# Altium project 243-TGE-Template.PrjPcb
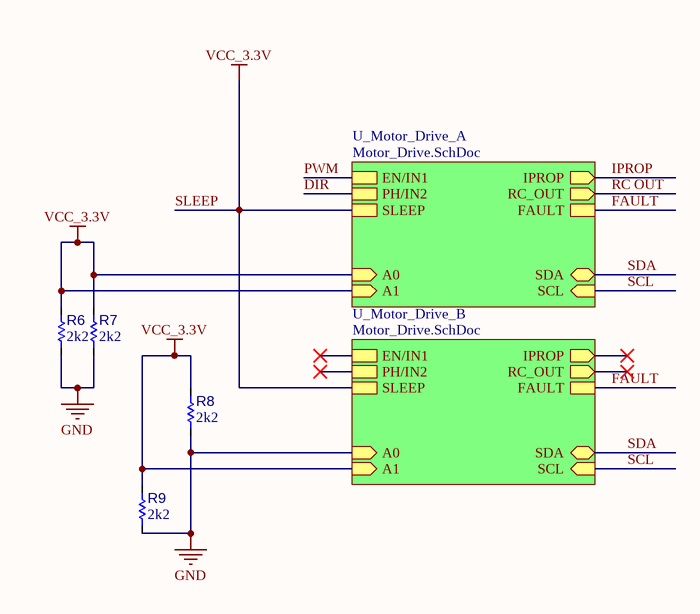
[diagram p0: Page_Tete.SchDoc]
NomDeLetudiant: Le nom de l'étudiant; NomDeProjet: Le nom de mon Projet; Revision: La Revision
4 sheets, 31 parts. Net scope: hierarchical (ports join the sheet entries above them; power ports are global).
Board file: Pcb1.PcbDoc
Sheets:
  Page_Tete.SchDoc
    U_Motor_Drive_A = Motor_Drive.SchDoc
    U_Motor_Drive_B = Motor_Drive.SchDoc
  Connecteur.SchDoc
  Interface_Mikrobus.SchDoc

## Sheet Page_Tete.SchDoc
size A4; SheetNumber: 1; SheetTotal: 4

### Parts
R6  value 2k2  [R_1005[0402]]  (hidden comment: Res 2k2 1% 0402)
R7  value 2k2  [R_1005[0402]]  (hidden comment: Res 2k2 1% 0402)
R8  value 2k2  [R_1005[0402]]  (hidden comment: Res 2k2 1% 0402)
R9  value 2k2  [R_1005[0402]]  (hidden comment: Res 2k2 1% 0402)

### Sub-sheets
U_Motor_Drive_A = Motor_Drive.SchDoc: EN/IN1, PH/IN2, SLEEP, IPROP (out), FAULT, SCL (in), SDA (bidir), A0 (in), A1 (in), RC_OUT (out)
U_Motor_Drive_B = Motor_Drive.SchDoc: EN/IN1, PH/IN2, SLEEP, IPROP (out), FAULT, SCL (in), SDA (bidir), A0 (in), A1 (in), RC_OUT (out)

### Nets
GND: R6.1 R7.1 R8.1 R9.1 ; sheet U_Motor_Drive_B/A0
SLEEP: R6.2 R7.2 R8.2 R9.2 ; sheet U_Motor_Drive_A/SLEEP, sheet U_Motor_Drive_A/A0, sheet U_Motor_Drive_A/A1, sheet U_Motor_Drive_B/SLEEP, sheet U_Motor_Drive_B/A1  [also labelled VCC_3.3V]
FAULT: sheet U_Motor_Drive_A/FAULT, sheet U_Motor_Drive_B/FAULT
SCL: sheet U_Motor_Drive_A/SCL, sheet U_Motor_Drive_B/SCL
SDA: sheet U_Motor_Drive_A/SDA, sheet U_Motor_Drive_B/SDA

### Library data of the parts
R6-R9 = RES008: Resistor type 1; Manufacturer 1: Yageo; Manufacturer Part Number 1: RC0402FR-072K2L; LibRef: RES008; Code CEGEP: RES2.2KSM; Puissance: 1/16W; Max Working Voltage: 50V; Tolerance: 1%; Mounting Technology: SMT; Supplier 1: LCSC; Supplier Part Number 1: C114762; Supplier 2: Digi-Key; Supplier Part Number 2: 311-2.20KLRCT-ND

## Sheet Motor_Drive.SchDoc: TITRE
size Letter; ApprovedBy: APPROUVÉ PAR; Author: Le nom de l'étudiant; Organization: Cegep Limoilou; Address1: 1300, 8e Avenue; Address2: Québec, QC; Address3: Canada; Address4: G1J 5L5; SheetNumber: 3; SheetTotal: 3
Used 2 times, as channels U_Motor_Drive_A, U_Motor_Drive_B. Parts and nets are listed once, with the designators drawn on the sheet.
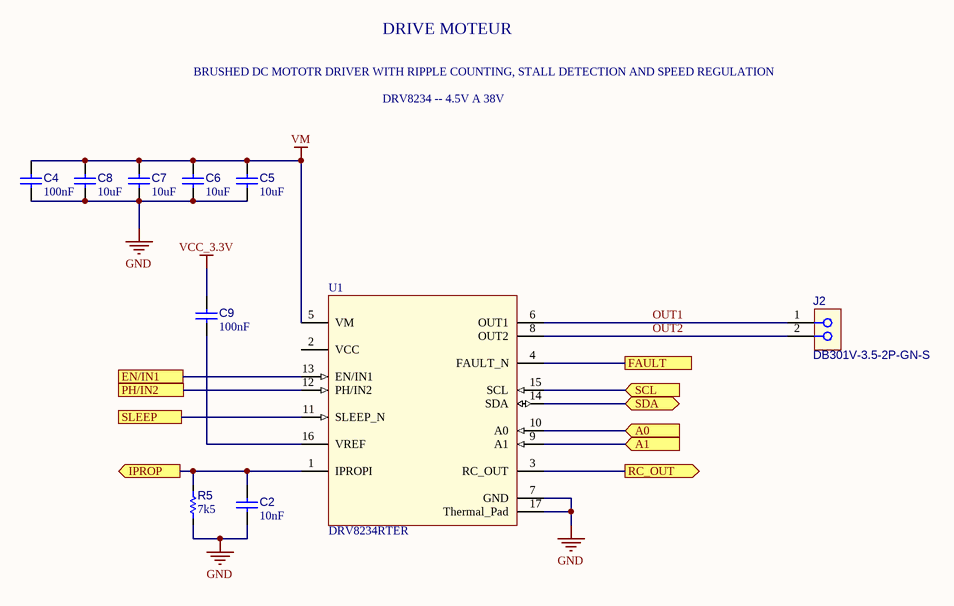
[diagram p1: Motor_Drive.SchDoc]

### Parts
C2  value 10nF  [C_1608[0603]]  (hidden comment: CAP CER 10nF 50V 0603)
C4  value 100nF  [C_2012[0805]]  (hidden comment: CAP CER 100nF 50V 0805)
C5  value 10uF  [C_2012[0805]]  (hidden comment: CAP CER 10uF 10V X7R 0805)
C6  value 10uF  [C_2012[0805]]  (hidden comment: CAP CER 10uF 10V X7R 0805)
C7  value 10uF  [C_2012[0805]]  (hidden comment: CAP CER 10uF 10V X7R 0805)
C8  value 10uF  [C_2012[0805]]  (hidden comment: CAP CER 10uF 10V X7R 0805)
C9  value 100nF  [C_2012[0805]]  (hidden comment: CAP CER 100nF 50V 0805)
J2  DB301V-3.5-2P-GN-S  [CONN_TERM_BLOCK_2POS_3mm5]
R5  value 7k5  [R_1005[0402]]  (hidden comment: Res 7k5 1% 0402)
U1  DRV8234RTER  [U_WQFN50P300X300-16]

### Ports
A0 (in), A1 (in), EN/IN1, FAULT, IPROP (out), PH/IN2, RC_OUT (out), SCL (in), SDA (bidir), SLEEP

### Nets
GND: C2.1 C4.1 C5.2 C6.1 C7.2 C8.1 R5.1 U1.7(GND) U1.17(Thermal_Pad)
VCC_3.3V: C9.2
VM: C4.2 C5.1 C6.2 C7.1 C8.2 U1.5(VM)
A0: U1.10(A0) ; port A0
A1: U1.9(A1) ; port A1
EN/IN1: U1.13(EN/IN1) ; port EN/IN1
FAULT: U1.4(FAULT_N) ; port FAULT
IPROP: C2.2 R5.2 U1.1(IPROPI) ; port IPROP
OUT1: J2.1 U1.6(OUT1)
OUT2: J2.2 U1.8(OUT2)
PH/IN2: U1.12(PH/IN2) ; port PH/IN2
RC_OUT: U1.3(RC_OUT) ; port RC_OUT
SCL: U1.15(SCL) ; port SCL
SDA: U1.14(SDA) ; port SDA
SLEEP: U1.11(SLEEP_N) ; port SLEEP
NetC9_1: C9.1 U1.16(VREF)

Not connected (* = marked no-connect by the designer): U1 2(VCC)

### Channels
U_Motor_Drive_A: designators end in _U_Motor_Drive_A; ports A0=SLEEP A1=SLEEP EN/IN1=PWM FAULT=FAULT IPROP=IPROP PH/IN2=DIR RC_OUT=RC OUT SCL=SCL SDA=SDA SLEEP=SLEEP
U_Motor_Drive_B: designators end in _U_Motor_Drive_B; ports A0=GND A1=SLEEP EN/IN1=NetU1_U_Motor_Drive_B_13 FAULT=FAULT IPROP=NetC2_U_Motor_Drive_B_2 PH/IN2=NetU1_U_Motor_Drive_B_12 RC_OUT=NetU1_U_Motor_Drive_B_3 SCL=SCL SDA=SDA SLEEP=SLEEP

### Notes on the sheet
- BRUSHED DC MOTOTR DRIVER WITH RIPPLE COUNTING, STALL DETECTION AND SPEED REGULATION
- DRIVE MOTEUR
- DRV8234 -- 4.5V A 38V
- Titre :
- Conception :
- Date :
- Approbation :
- Heure :
- Révision :
- Feuille
- de
- Fichier :

### Library data of the parts
C2 = CAP007: Capacitor type 1; Manufacturer 1: Yageo; Manufacturer Part Number 1: CC0603KRX7R9BB103; LibRef: CAP007; Tolerance: 10%; Dielectric: X7R; Rated Voltage: 50V; Mounting Technology: SMT; Supplier 1: LCSC; Supplier Part Number 1: C100042
C4 C9 = CAP008: Capacitor type 1; Manufacturer 1: Yageo; Manufacturer Part Number 1: CC0805KRX7R9BB104; LibRef: CAP008; Code CEGEP: KCOND0142SM; Tolerance: 10%; Dielectric: X7R; Rated Voltage: 50V; Mounting Technology: SMT; Supplier 1: LCSC; Supplier Part Number 1: C49678
C5-C8 = CAP004: Capacitor type 1; Manufacturer 1: muRata; Manufacturer Part Number 1: GRM21BR71A106KE51L; LibRef: CAP004; Code CEGEP: KCOND03SM; Tolerance: 10%; Rated Voltage: 10V; Dielectric: X7R; Mounting Technology: SMT; Supplier 1: LCSC; Supplier Part Number 1: C86038
J2 = CONN-3MM5-2POS-TERM-BLOCK: CONN TERM BLOCK 2POS 3.5mm pitch; Manufacturer 1: Dorabo; Supplier 1: LCSC; Supplier Part Number 1: C695629; Manufacturer Part Number 1: DB301V-3.5-2P-GN-S; Mounting Technology: TH
R5 = RES027: Resistor type 1; Manufacturer 1: Yageo; Manufacturer Part Number 1: RC0402FR-077k5L; LibRef: RES027; Puissance: 1/16W; Max Working Voltage: 50V; Tolerance: 1%; Mounting Technology: SMT; Supplier 1: LCSC; Supplier Part Number 1: C137934
U1 = U_DRV8234: Brushed DC H-bridge Motor Driver with Ripple Counting, Stall Detection, and Speed Regulation 38V 2A 16-WQFN; Manufacturer 1: Texas Instruments; Mounting Technology: SMT; Manufacturer Part Number 1: DRV8234RTER; Supplier 1: LCSC

## Sheet Connecteur.SchDoc: TITRE
size Letter; ApprovedBy: APPROUVÉ PAR; Author: Le nom de l'étudiant; Organization: Cegep Limoilou; Address1: 1300, 8e Avenue; Address2: Québec, QC; Address3: Canada; Address4: G1J 5L5; SheetNumber: 2; SheetTotal: 3
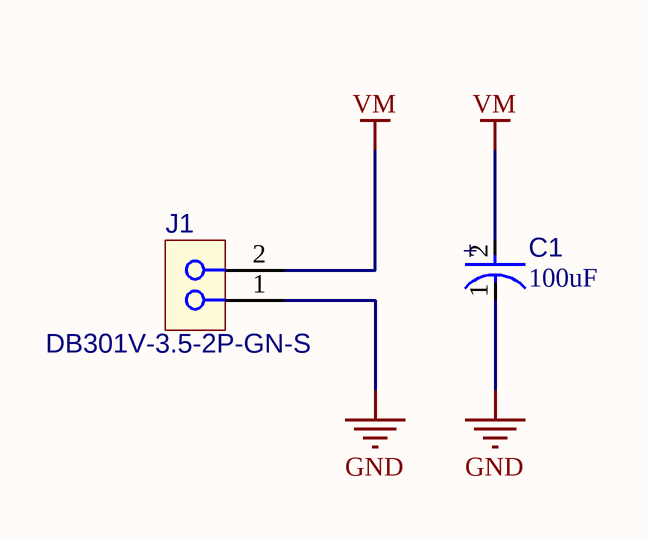
[diagram p2: Connecteur.SchDoc]

### Parts
C1  value 100uF  [C_EL_D10MM-L11MM]  (hidden comment: CAP EL 100uF 63V 10MM)
J1  DB301V-3.5-2P-GN-S  [CONN_TERM_BLOCK_2POS_3mm5]

### Nets
GND: C1.1(C) J1.1
VM: C1.2(A) J1.2

### Notes on the sheet
- Titre :
- Conception :
- Date :
- Approbation :
- Heure :
- Révision :
- Feuille
- de
- Fichier :
- (in symbol CAP021) +

### Library data of the parts
C1 = CAP021: Capacitor type EL; Manufacturer 1: HRK; Manufacturer Part Number 1: GVT1J107M1010CNVC; LibRef: CAP021; Tolerance: 20%; Rated Voltage: 63V; Dielectric: EL; Mounting Technology: SMT; Supplier 1: LCSC; Supplier Part Number 1: C2983410
J1 = CONN-3MM5-2POS-TERM-BLOCK: as J2 on sheet Motor_Drive; Supplier 1: LCSC; Supplier Part Number 1: C695629; Manufacturer Part Number 1: DB301V-3.5-2P-GN-S; Mounting Technology: TH

## Sheet Interface_Mikrobus.SchDoc: TITRE
size Letter; ApprovedBy: APPROUVÉ PAR; Author: Le nom de l'étudiant; Organization: Cegep Limoilou; Address1: 1300, 8e Avenue; Address2: Québec, QC; Address3: Canada; Address4: G1J 5L5; SheetNumber: 3; SheetTotal: 4
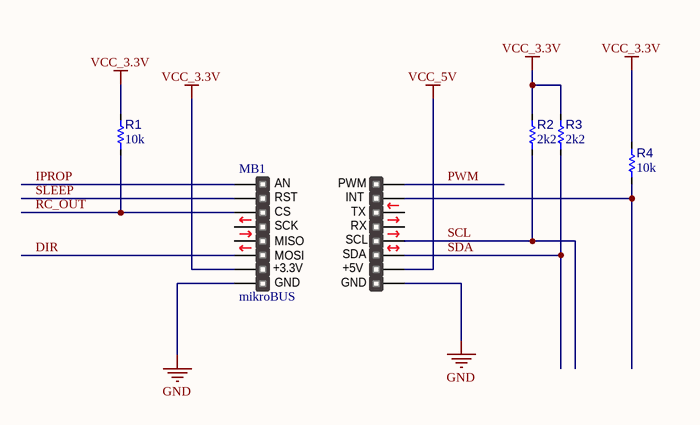
[diagram p3: Interface_Mikrobus.SchDoc]

### Parts
MB1  mikroBUS  [mikroBUS - Large]  (no BOM)
R1  value 10k  [R_1005[0402]]  (hidden comment: Res 10k 1% 0402)
R2  value 2k2  [R_1005[0402]]  (hidden comment: Res 2k2 1% 0402)
R3  value 2k2  [R_1005[0402]]  (hidden comment: Res 2k2 1% 0402)
R4  value 10k  [R_1005[0402]]  (hidden comment: Res 10k 1% 0402)

### Nets
GND: MB1.8(GND) MB1.9(GND)
VCC_3.3V: MB1.7(3.3V) R1.2 R2.2 R3.2 R4.2  [project net SLEEP]
VCC_5V: MB1.10(5V)
DIR: MB1.6(MOSI)
IPROP: MB1.1(AN)
PWM: MB1.16(PWM)
RC_OUT: MB1.3(CS) R1.1
SCL: MB1.12(SCL) R2.1
SDA: MB1.11(SDA) R3.1
SLEEP: MB1.2(RST)
NetMB1_15: MB1.15(INT) R4.1

Not connected (* = marked no-connect by the designer): MB1 4(SCK) 5(MISO) 13(TX) 14(RX)

### Notes on the sheet
- Titre :
- Conception :
- Date :
- Approbation :
- Heure :
- Révision :
- Feuille
- de
- Fichier :
- (in symbol mikroBUS compatible add-on board) +3.3V; +5V

### Library data of the parts
MB1 = mikroBUS compatible add-on board
R1 R4 = RES003: Resistor type 1; Manufacturer 1: Yageo; Manufacturer Part Number 1: RC0402FR-0710KL; LibRef: RES003; Puissance: 1/16W; Max Working Voltage: 50V; Tolerance: 1%; Mounting Technology: SMT; Supplier 1: LCSC; Supplier Part Number 1: C60490
R2 R3 = RES008: as R6 on sheet Page_Tete; Tolerance: 1%; Mounting Technology: SMT; Supplier 1: LCSC; Supplier Part Number 1: C114762; Supplier 2: Digi-Key; Supplier Part Number 2: 311-2.20KLRCT-ND

## Nets that join several sheets
GND: Page_Tete (R6.1 R7.1 R8.1 R9.1), U_Motor_Drive_A (9 pins), U_Motor_Drive_B (10 pins), Connecteur (C1.1 J1.1), Interface_Mikrobus (MB1.8 MB1.9)
SLEEP: Page_Tete (R6.2 R7.2 R8.2 R9.2), U_Motor_Drive_A (C9_U_Motor_Drive_A.2 U1_U_Motor_Drive_A.9 U1_U_Motor_Drive_A.10 U1_U_Motor_Drive_A.11), U_Motor_Drive_B (C9_U_Motor_Drive_B.2 U1_U_Motor_Drive_B.9 U1_U_Motor_Drive_B.11), Interface_Mikrobus (5 pins)
VM: U_Motor_Drive_A (6 pins), U_Motor_Drive_B (6 pins), Connecteur (C1.2 J1.2)
FAULT: U_Motor_Drive_A (U1_U_Motor_Drive_A.4), U_Motor_Drive_B (U1_U_Motor_Drive_B.4)
SCL: U_Motor_Drive_A (U1_U_Motor_Drive_A.15), U_Motor_Drive_B (U1_U_Motor_Drive_B.15)
SDA: U_Motor_Drive_A (U1_U_Motor_Drive_A.14), U_Motor_Drive_B (U1_U_Motor_Drive_B.14)